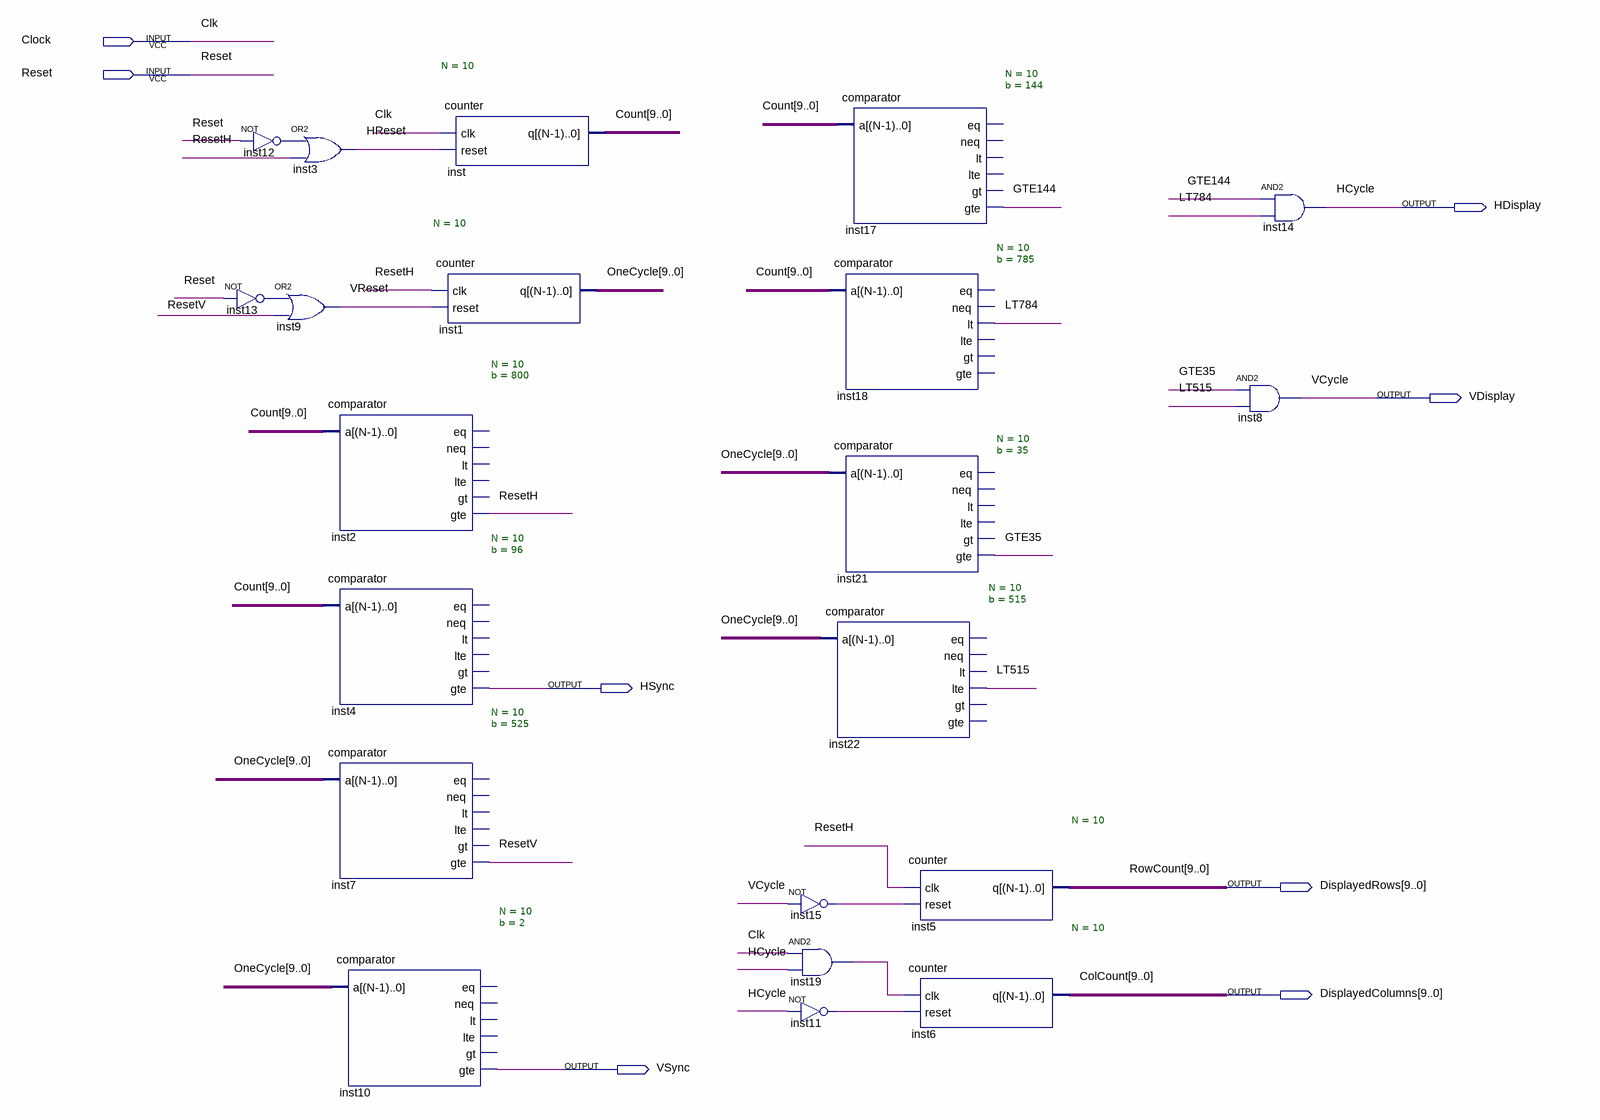
[diagram p0: schematic sheet]
// Quartus schematic SyncCount.bdf as structural Verilog: 21 symbols, 8 pins
module SyncCount (
  input  Clock,
  input  Reset,
  output HDisplay,
  output VDisplay,
  output HSync,
  output [9:0] DisplayedRows,
  output [9:0] DisplayedColumns,
  output VSync
);

  wire GTE35, GTE144, HReset, inst11_out, inst12_out, inst13_out, inst15_out, inst19_out, LT515, LT784,
       ResetH, ResetV, VReset;
  wire [9:0] Count, OneCycle;

  not inst13 (inst13_out, Reset);
  or inst3 (HReset, inst12_out, ResetH);
  not inst12 (inst12_out, Reset);
  or inst9 (VReset, inst13_out, ResetV);
  comparator #(.N(10), .b(800)) inst2 (.a(Count), .gte(ResetH));  // open: eq, neq, lt, lte, gt
  comparator #(.N(10), .b(96)) inst4 (.a(Count), .gte(HSync));  // open: eq, neq, lt, lte, gt
  comparator #(.N(10), .b(525)) inst7 (.a(OneCycle), .gte(ResetV));  // open: eq, neq, lt, lte, gt
  comparator #(.N(10), .b(2)) inst10 (.a(OneCycle), .gte(VSync));  // open: eq, neq, lt, lte, gt
  counter #(.N(10)) inst1 (.clk(ResetH), .reset(VReset), .q(OneCycle));
  counter #(.N(10)) inst (.clk(Clock), .reset(HReset), .q(Count));
  comparator #(.N(10), .b(785)) inst18 (.a(Count), .lt(LT784));  // open: eq, neq, lte, gt, gte
  comparator #(.N(10), .b(35)) inst21 (.a(OneCycle), .gte(GTE35));  // open: eq, neq, lt, lte, gt
  comparator #(.N(10), .b(515)) inst22 (.a(OneCycle), .lte(LT515));  // open: eq, neq, lt, gt, gte
  not inst15 (inst15_out, VDisplay);
  and inst19 (inst19_out, Clock, HDisplay);
  not inst11 (inst11_out, HDisplay);
  comparator #(.N(10), .b(144)) inst17 (.a(Count), .gte(GTE144));  // open: eq, neq, lt, lte, gt
  counter #(.N(10)) inst5 (.clk(ResetH), .reset(inst15_out), .q(DisplayedRows));
  counter #(.N(10)) inst6 (.clk(inst19_out), .reset(inst11_out), .q(DisplayedColumns));
  and inst14 (HDisplay, GTE144, LT784);
  and inst8 (VDisplay, GTE35, LT515);

  // Other names for the same wires on the sheet: Clk = Clock; ColCount[9:0] = DisplayedColumns; HCycle = HDisplay;
  //   RowCount[9:0] = DisplayedRows; VCycle = VDisplay
endmodule
